# Altium project CLKE.PrjPcb
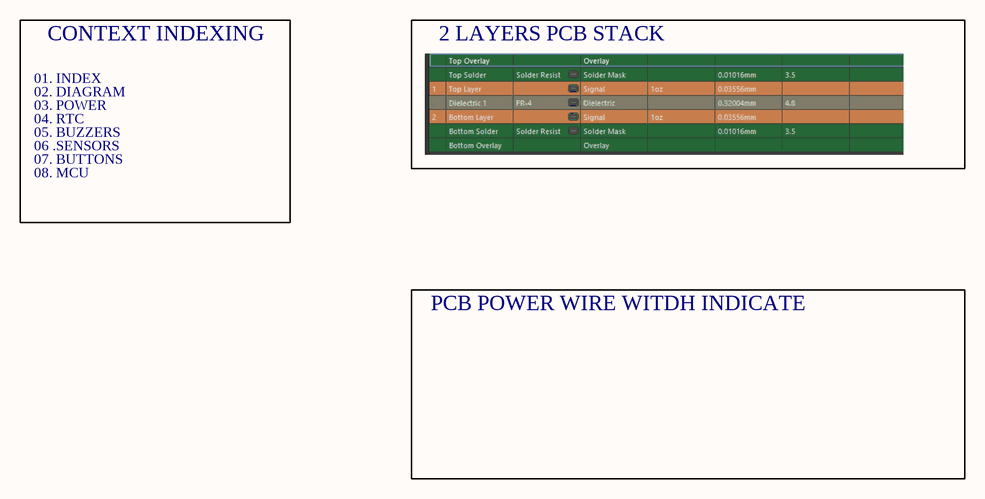
[diagram p0: INDEX.SchDoc]
9 sheets, 76 parts. Net scope: hierarchical (ports join the sheet entries above them; power ports are global).
Board file: PCB1.PcbDoc
Sheets:
  INDEX.SchDoc
  DIAGRAM.SchDoc
    POWER = POWER.SchDoc
    DISPLAY = DISPLAY.SchDoc
    SENSORS = SENSORS.SchDoc
    BUTTONS = BUTTONS.SchDoc
    RTC = RTC.SchDoc
    MCU = MCU.SchDoc
    BUZZERS = BUZZERS.SchDoc

## Sheet INDEX.SchDoc
size A4; SheetNumber: 1; SheetTotal: 9

### Notes on the sheet
- 01. INDEX
- CONTEXT INDEXING
- 2 LAYERS PCB STACK
- 02. DIAGRAM
- 03. POWER
- 04. RTC
- 05. BUZZERS
- 06 .SENSORS
- 07. BUTTONS
- 08. MCU
- PCB POWER WIRE WITDH INDICATE

## Sheet DIAGRAM.SchDoc
size A3; SheetNumber: 1; SheetTotal: 8
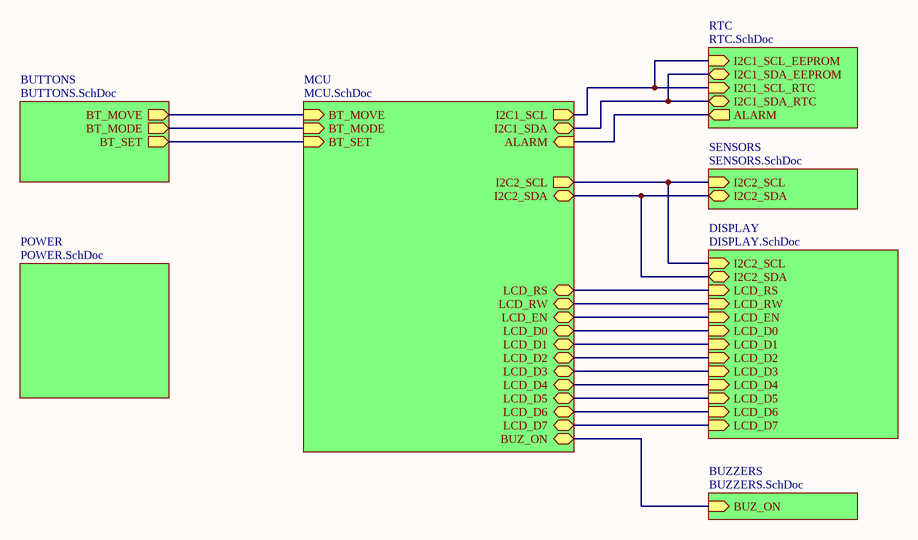
[diagram p1: DIAGRAM.SchDoc]

### Sub-sheets
BUTTONS = BUTTONS.SchDoc: BT_MOVE (out), BT_MODE (out), BT_SET (out)
BUZZERS = BUZZERS.SchDoc: BUZ_ON (in)
DISPLAY = DISPLAY.SchDoc: LCD_RS (in), LCD_RW (in), LCD_EN (in), LCD_D1 (in), LCD_D2 (in), LCD_D3 (in), LCD_D4 (in), LCD_D5 (in), LCD_D6 (in), LCD_D7 (in), I2C2_SCL (in), I2C2_SDA (bidir), LCD_D0 (in)
MCU = MCU.SchDoc: LCD_RS (bidir), LCD_RW (bidir), LCD_EN (bidir), LCD_D1 (bidir), LCD_D2 (bidir), LCD_D3 (bidir), LCD_D4 (bidir), LCD_D5 (bidir), LCD_D6 (bidir), LCD_D7 (bidir), LCD_D0 (bidir), BT_MOVE (in), BT_MODE (in), BT_SET (in), I2C2_SCL (out), I2C2_SDA (bidir), I2C1_SCL (out), I2C1_SDA (bidir), ALARM (in), BUZ_ON (bidir)
POWER = POWER.SchDoc: no entries
RTC = RTC.SchDoc: I2C1_SCL_RTC (in), I2C1_SDA_RTC (bidir), ALARM (out), I2C1_SCL_EEPROM (in), I2C1_SDA_EEPROM (bidir)
SENSORS = SENSORS.SchDoc: I2C2_SCL (in), I2C2_SDA (bidir)

### Nets
NetC8_2: sheet BUTTONS/BT_MODE, sheet MCU/BT_MODE
NetC9_2: sheet BUTTONS/BT_MOVE, sheet MCU/BT_MOVE
NetC10_2: sheet BUTTONS/BT_SET, sheet MCU/BT_SET
NetDS1_3: sheet DISPLAY/I2C2_SCL, sheet SENSORS/I2C2_SCL, sheet MCU/I2C2_SCL
NetDS1_4: sheet DISPLAY/I2C2_SDA, sheet SENSORS/I2C2_SDA, sheet MCU/I2C2_SDA
NetR2_1: sheet RTC/I2C1_SCL_RTC, sheet RTC/I2C1_SCL_EEPROM, sheet MCU/I2C1_SCL
NetR10_1: sheet RTC/I2C1_SDA_RTC, sheet RTC/I2C1_SDA_EEPROM, sheet MCU/I2C1_SDA
NetR14_1: sheet MCU/BUZ_ON, sheet BUZZERS/BUZ_ON
NetR25_1: sheet RTC/ALARM, sheet MCU/ALARM
NetU2_4: sheet DISPLAY/LCD_RS, sheet MCU/LCD_RS
NetU2_5: sheet DISPLAY/LCD_RW, sheet MCU/LCD_RW
NetU2_6: sheet DISPLAY/LCD_EN, sheet MCU/LCD_EN
NetU2_7: sheet DISPLAY/LCD_D0, sheet MCU/LCD_D0
NetU2_8: sheet DISPLAY/LCD_D1, sheet MCU/LCD_D1
NetU2_9: sheet DISPLAY/LCD_D2, sheet MCU/LCD_D2
NetU2_10: sheet DISPLAY/LCD_D3, sheet MCU/LCD_D3
NetU2_11: sheet DISPLAY/LCD_D4, sheet MCU/LCD_D4
NetU2_12: sheet DISPLAY/LCD_D5, sheet MCU/LCD_D5
NetU2_13: sheet DISPLAY/LCD_D6, sheet MCU/LCD_D6
NetU2_14: sheet DISPLAY/LCD_D7, sheet MCU/LCD_D7

## Sheet POWER.SchDoc
size A3; SheetNumber: 3; SheetTotal: 9
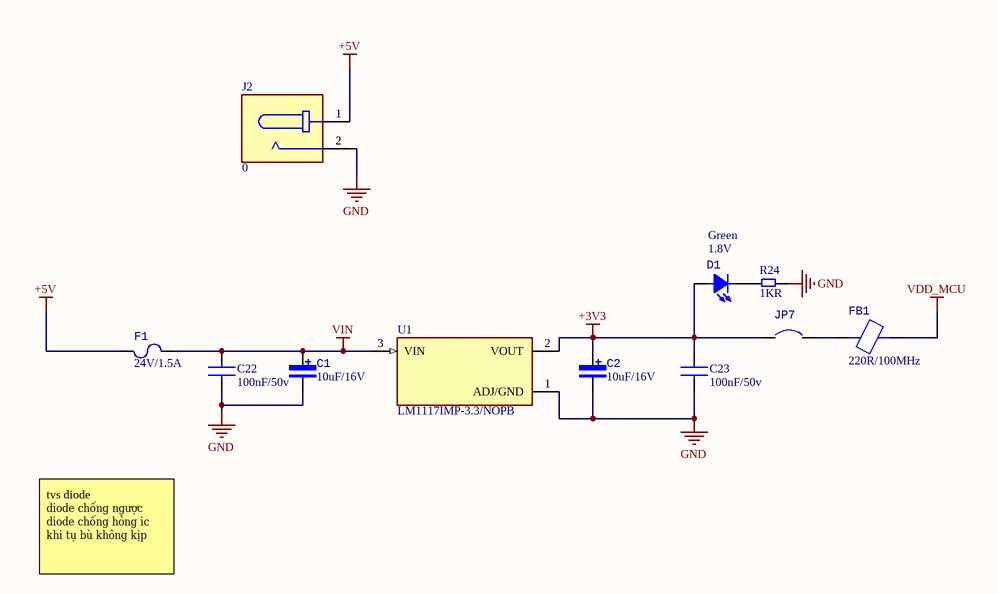
[diagram p2: POWER.SchDoc]

### Parts
C1  10uF/16V  [CAP_Tantalum_3216]
C2  10uF/16V  [CAP_Tantalum_3216]
C22  100nF/50v  [CAP-CER-0805]
C23  100nF/50v  [CAP-CER-0805]
D1  Mfr# #: Green  [LED_SMD_0805_GREEN]  (hidden comment: 1.8V)
F1  24V/1.5A  [FUSER_MF-MSMF150/24X-2]
FB1  220R/100MHz  [FERRITE-0603]
J2  0  [CUI_PJ-037AH]
JP7  JUMPER-2POS  [JUMPER-2POS-2.54]  (value not drawn)
R24  1KR  [RES-SMD-0805]
U1  LM1117IMP-3.3/NOPB  [LM1117IMP-3.3/NOPB]

### Nets
+3V3: C2.1 C23.2 D1.1(A) JP7.1 U1.2(VOUT)
+5V: F1.2 J2.1
GND: C1.2 C2.2 C22.1 C23.1 J2.2 R24.2 U1.1(ADJ/GND)
VDD_MCU: FB1.2
VIN: C1.1 C22.2 F1.1 U1.3(VIN)
NetD1_2: D1.2(K) R24.1
NetFB1_1: FB1.1 JP7.2

### Notes on the sheet
- tvs diode
  diode chống ngược
  diode chống hỏng ic khi tụ bù không kịp

### Library data of the parts
C1 C2 = ID-25: Tụ Tantalum 10uF 16V 1206 TAJA106K016RNJ; Design Item ID: ID-25; Value: 10uF/16V
C22 C23 = CAP-CER
D1 = ID-26: LED Xanh Lá 0805 Dán SMD Trong Suốt Harvatek; Design Item ID: ID-26; Value: 1.8V
F1 = ID-29: MF-MSMF150/24X-2 Cầu Chì Tự Phục Hồi 1812 24V 1.5A; Design Item ID: ID-29; Value: 24V/1.5A
FB1 = ID-27: Design Item ID: ID-27; Value: 220R/100MHz
J2 = JACK DC: 2.0 x 6.5 mm, 5.0 A, Horizontal, Through Hole, Dc Power Jack Connector; MF: Same Sky; MP: PJ-037AH; SnapEDA_Link: https://www.snapeda.com/parts/PJ-037AH/Same+Sky/view-part/?ref=snap; Package: None; Value: *; Check_prices: https://www.snapeda.com/parts/PJ-037AH/Same+Sky/view-part/?ref=eda
JP7 = ID-7: Design Item ID: ID-7
R24 = RES_SMD
U1 = LDO: 800-mA 15-V linear voltage regulator; MF: Texas Instruments; SnapEDA_Link: https://www.snapeda.com/parts/LM1117IMP-3.3/NOPB/Texas+Instruments/view-part/?ref=snap; Package: SOT-223-4 Texas Instruments; Value: *; MP: LM1117IMP-3.3/NOPB; Check_prices: https://www.snapeda.com/parts/LM1117IMP-3.3/NOPB/Texas+Instruments/view-part/?ref=eda

## Sheet DISPLAY.SchDoc
size A3; SheetNumber: 4; SheetTotal: 9
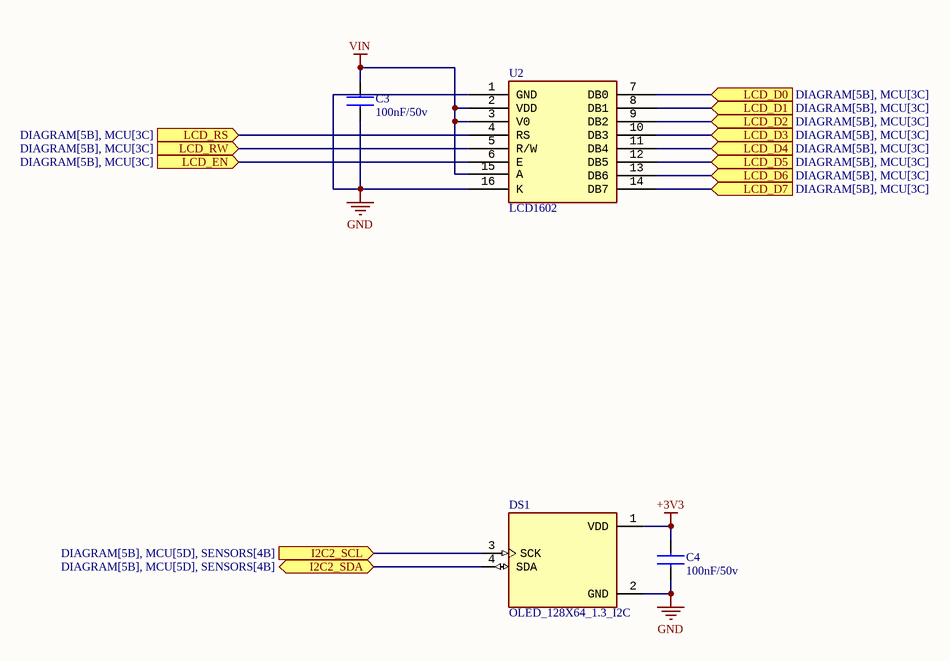
[diagram p3: DISPLAY.SchDoc]

### Parts
C3  100nF/50v  [CAP-CER-0805]
C4  100nF/50v  [CAP-CER-0805]
DS1  OLED_128X64_1.3_I2C  [LCD_OLED_128X64_1.3_I2C]
U2  LCD1602  [LCD16X2]

### Ports
I2C2_SCL (in, see DIAGRAM[5B], MCU[5D], SENSORS[4B]), I2C2_SDA (bidir, see DIAGRAM[5B], MCU[5D], SENSORS[4B]), LCD_D0 (in, see DIAGRAM[5B], MCU[3C]), LCD_D1 (in, see DIAGRAM[5B], MCU[3C]), LCD_D2 (in, see DIAGRAM[5B], MCU[3C]), LCD_D3 (in, see DIAGRAM[5B], MCU[3C]), LCD_D4 (in, see DIAGRAM[5B], MCU[3C]), LCD_D5 (in, see DIAGRAM[5B], MCU[3C]), LCD_D6 (in, see DIAGRAM[5B], MCU[3C]), LCD_D7 (in, see DIAGRAM[5B], MCU[3C]), LCD_EN (in, see DIAGRAM[5B], MCU[3C]), LCD_RS (in, see DIAGRAM[5B], MCU[3C]), LCD_RW (in, see DIAGRAM[5B], MCU[3C])

### Nets
+3V3: C4.2 DS1.1(VDD)
GND: C3.1 C4.1 DS1.2(GND) U2.1(GND) U2.16(K)
VIN: C3.2 U2.2(VDD) U2.3(V0) U2.15(A)
NetDS1_3: DS1.3(SCK) ; port I2C2_SCL
NetDS1_4: DS1.4(SDA) ; port I2C2_SDA
NetU2_4: U2.4(RS) ; port LCD_RS
NetU2_5: U2.5(R/W) ; port LCD_RW
NetU2_6: U2.6(E) ; port LCD_EN
NetU2_7: U2.7(DB0) ; port LCD_D0
NetU2_8: U2.8(DB1) ; port LCD_D1
NetU2_9: U2.9(DB2) ; port LCD_D2
NetU2_10: U2.10(DB3) ; port LCD_D3
NetU2_11: U2.11(DB4) ; port LCD_D4
NetU2_12: U2.12(DB5) ; port LCD_D5
NetU2_13: U2.13(DB6) ; port LCD_D6
NetU2_14: U2.14(DB7) ; port LCD_D7

### Library data of the parts
C3 C4 = CAP-CER
DS1 = ID-5: MF: UNIVERSAL-SOLDER Electronics Ltd; MP: OLED 128x64 1.3&quot; I2C; SnapEDA_Link: https://www.snapeda.com/parts/OLED%20128x64%201.3%22%20I2C/UNIVERSAL-SOLDER+Electronics+Ltd/view-part/?ref=snap; Package: None; Value: *; Check_prices: https://www.snapeda.com/parts/OLED%20128x64%201.3%22%20I2C/UNIVERSAL-SOLDER+Electronics+Ltd/view-part/?ref=eda; Design Item ID: ID-5; Mfr# #: OLED_128X64_1.3_I2C

## Sheet SENSORS.SchDoc
size A3; SheetNumber: 6; SheetTotal: 8
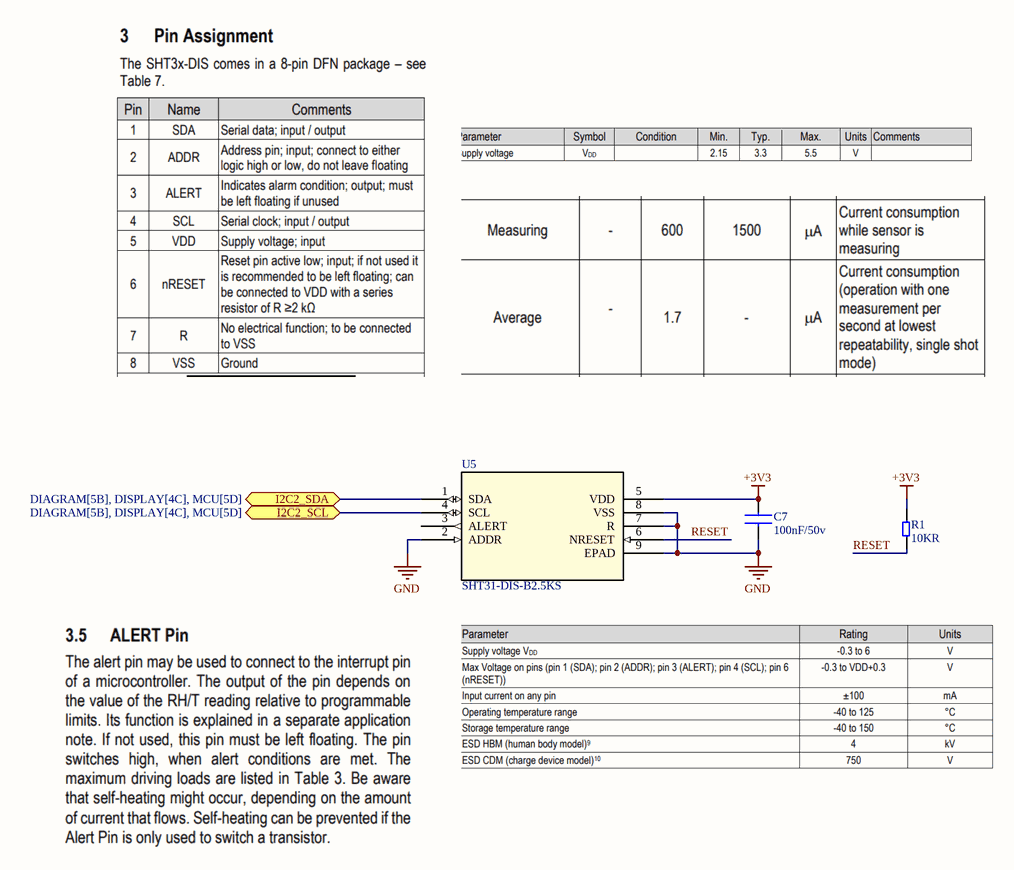
[diagram p4: SENSORS.SchDoc]

### Parts
C7  100nF/50v  [CAP-CER-0805]
R1  10KR  [RES-SMD-0805]
U5  SHT31-DIS-B2.5KS  [SHT31-DIS-B2.5KS_U_SHT3_SEN]

### Ports
I2C2_SCL (bidir, see DIAGRAM[5B], DISPLAY[4C], MCU[5D]), I2C2_SDA (bidir, see DIAGRAM[5B], DISPLAY[4C], MCU[5D])

### Nets
+3V3: C7.2 R1.2 U5.5(VDD)
GND: C7.1 U5.2(ADDR) U5.7(R) U5.8(VSS) U5.9(EPAD)
RESET: R1.1 U5.6(NRESET)
NetDS1_3: U5.4(SCL) ; port I2C2_SCL
NetDS1_4: U5.1(SDA) ; port I2C2_SDA

Not connected (* = marked no-connect by the designer): U5 3(ALERT)

### Library data of the parts
C7 = CAP-CER
R1 = ID-4: Điện Trở 10 KOhm 0805 1%; Design Item ID: ID-4; Value: 10KR
U5 = ID-3: Humidity, Temperature 0 ~ 100% RH I2C ±2% RH 8 s Surface Mount; Manufacturer_Name: Sensirion; Copyright: Copyright (C) 2025 Ultra Librarian. All rights reserved.; Manufacturer_Part_Number: SHT31-DIS-B2.5KS; RefDes: RefDes; Type: Type; Design Item ID: ID-3; Mfr# #: SHT31-DIS-B2.5KS

## Sheet BUTTONS.SchDoc
size A3; SheetNumber: 7; SheetTotal: 8
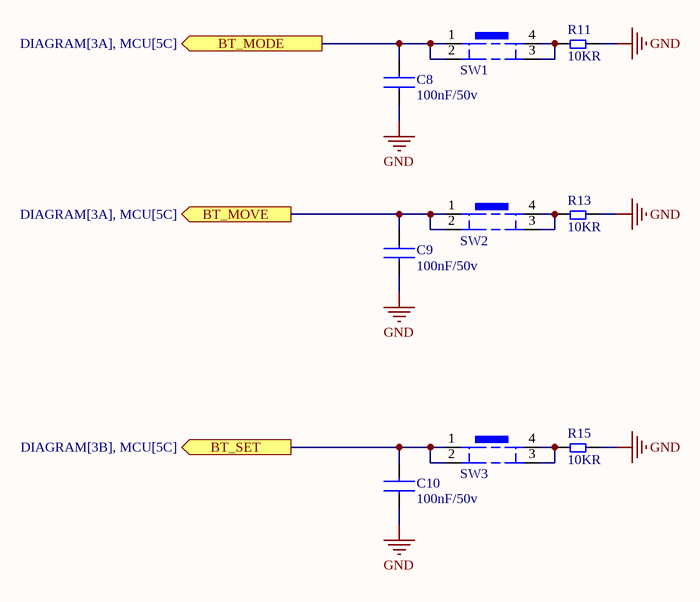
[diagram p5: BUTTONS.SchDoc]

### Parts
C8  100nF/50v  [CAP-CER-0805]
C9  100nF/50v  [CAP-CER-0805]
C10  100nF/50v  [CAP-CER-0805]
R11  10KR  [RES-SMD-0805]
R13  10KR  [RES-SMD-0805]
R15  10KR  [RES-SMD-0805]
SW1  0  [Tactice-Switch-TH-12x12-4.5mm]  (value not drawn)
SW2  0  [Tactice-Switch-TH-12x12-4.5mm]  (value not drawn)
SW3  0  [Tactice-Switch-TH-12x12-4.5mm]  (value not drawn)

### Ports
BT_MODE (out, see DIAGRAM[3A], MCU[5C]), BT_MOVE (out, see DIAGRAM[3A], MCU[5C]), BT_SET (out, see DIAGRAM[3B], MCU[5C])

### Nets
GND: C8.1 C9.1 C10.1 R11.1 R13.1 R15.1
NetC8_2: C8.2 SW1.1 SW1.2 ; port BT_MODE
NetC9_2: C9.2 SW2.1 SW2.2 ; port BT_MOVE
NetC10_2: C10.2 SW3.1 SW3.2 ; port BT_SET
NetR11_2: R11.2 SW1.3 SW1.4
NetR13_2: R13.2 SW2.3 SW2.4
NetR15_2: R15.2 SW3.3 SW3.4

### Library data of the parts
C8-C10 = ID-14: Tụ Gốm 0805 100nF (0.1uF) 50V; Design Item ID: ID-14; Value: 100nF/50v
R11 R13 R15 = ID-4: Điện Trở 10 KOhm 0805 1%; Design Item ID: ID-4; Value: 10KR
SW1-SW3 = ID-18: Nút Nhấn 6x6mm Cao 6mm 4 Chân Xuyên Lỗ; Design Item ID: ID-18

## Sheet RTC.SchDoc
size A3; SheetNumber: 5; SheetTotal: 9
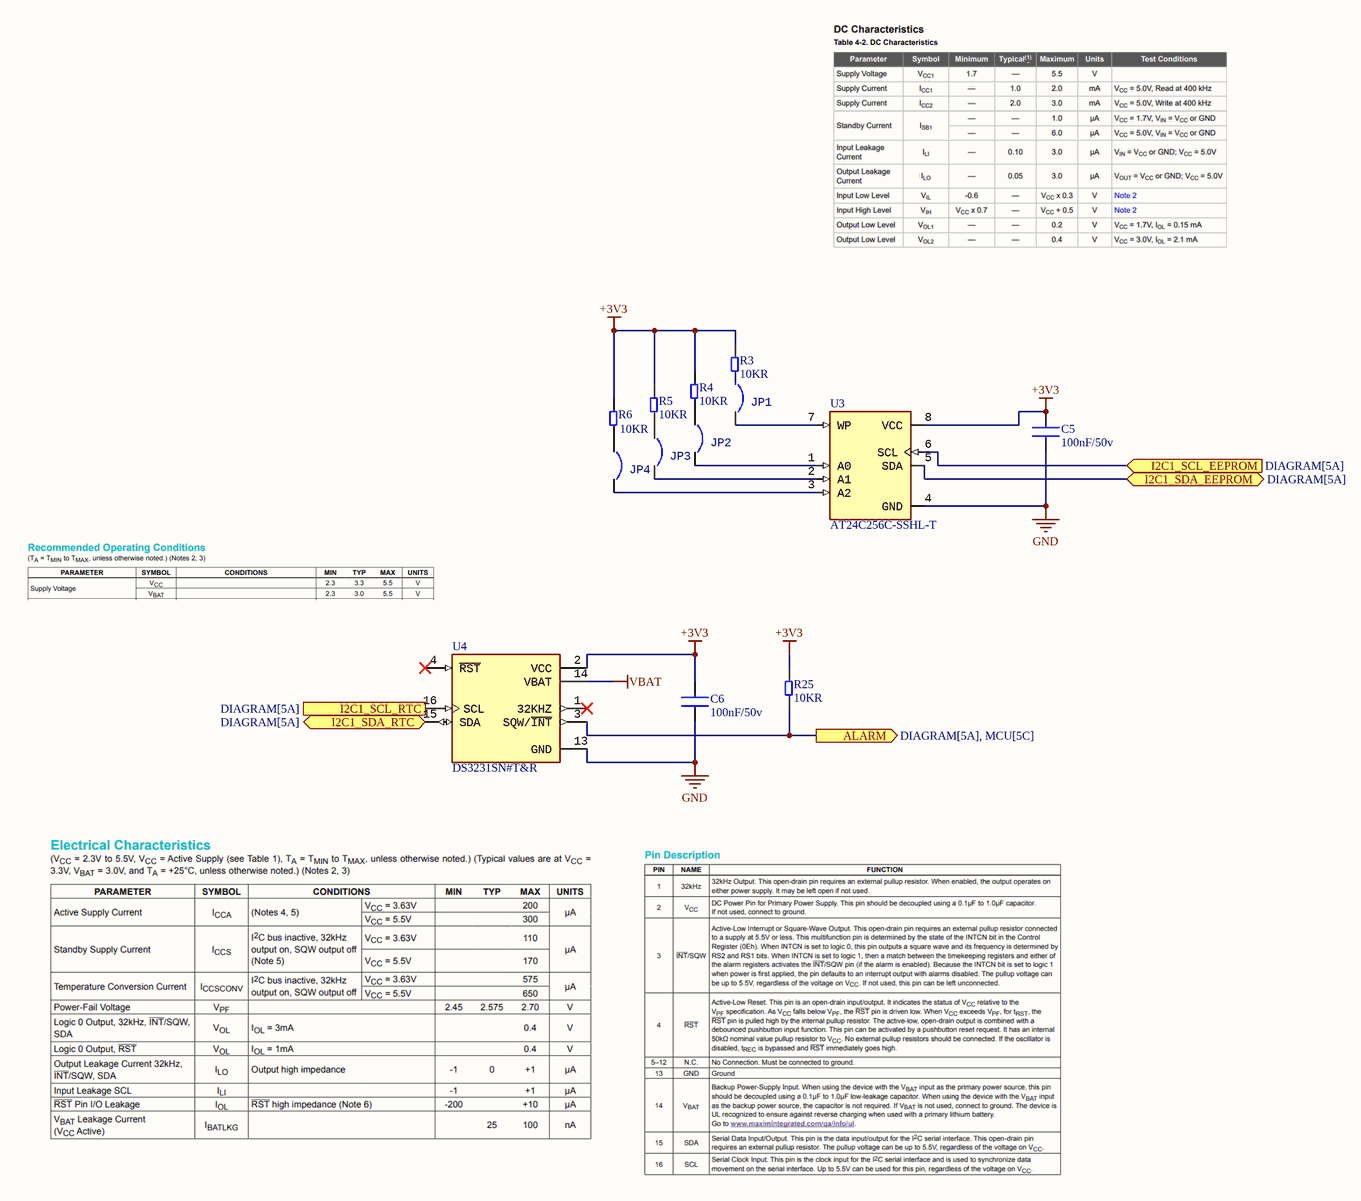
[diagram p6: RTC.SchDoc]

### Parts
C5  100nF/50v  [CAP-CER-0805]
C6  100nF/50v  [CAP-CER-0805]
JP1  JUMPER-2POS  [JUMPER-2POS-2.54]  (value not drawn)
JP2  JUMPER-2POS  [JUMPER-2POS-2.54]  (value not drawn)
JP3  JUMPER-2POS  [JUMPER-2POS-2.54]  (value not drawn)
JP4  JUMPER-2POS  [JUMPER-2POS-2.54]  (value not drawn)
R3  10KR  [RES-SMD-0805]
R4  10KR  [RES-SMD-0805]
R5  10KR  [RES-SMD-0805]
R6  10KR  [RES-SMD-0805]
R25  10KR  [RES-SMD-0805]
U3  AT24C256C-SSHL-T  [AT24C256C-SSHL-T]
U4  DS3231SN#T&R  [DS3231SN_SOIC127P1032X265-16N]

### Ports
ALARM (out, see DIAGRAM[5A], MCU[5C]), I2C1_SCL_EEPROM (in, see DIAGRAM[5A]), I2C1_SCL_RTC (in, see DIAGRAM[5A]), I2C1_SDA_EEPROM (bidir, see DIAGRAM[5A]), I2C1_SDA_RTC (bidir, see DIAGRAM[5A])

### Nets
+3V3: C5.2 C6.2 R3.2 R4.2 R5.2 R6.2 R25.2 U3.8(VCC) U4.2(VCC)
GND: C5.1 C6.1 U3.4(GND) U4.13(GND)
VBAT: U4.14(VBAT)
NetJP1_1: JP1.1 R3.1
NetJP1_2: JP1.2 U3.7(WP)
NetJP2_1: JP2.1 R4.1
NetJP2_2: JP2.2 U3.1(A0)
NetJP3_1: JP3.1 R5.1
NetJP3_2: JP3.2 U3.2(A1)
NetJP4_1: JP4.1 R6.1
NetJP4_2: JP4.2 U3.3(A2)
NetR2_1: U3.6(SCL) U4.16(SCL) ; port I2C1_SCL_EEPROM, port I2C1_SCL_RTC
NetR10_1: U3.5(SDA) U4.15(SDA) ; port I2C1_SDA_EEPROM, port I2C1_SDA_RTC
NetR25_1: R25.1 U4.3(SQW/~{INT}) ; port ALARM

Not connected (* = marked no-connect by the designer): U4 1(32KHZ)* 4(~{RST})*

### Library data of the parts
C5 C6 = CAP-CER
JP1-JP4 = ID-7: Design Item ID: ID-7
R3-R6 R25 = RES_SMD
U3 = ID-9: EEPROM Memory IC 256Kbit I2C 1 MHz 550 ns 8-SOIC; Design Item ID: ID-9; Mfr# #: AT24C256C-SSHL-T
U4 = ID-8: Real Time Clock (RTC) IC Clock/Calendar I2C, 2-Wire Serial 16-SOIC (0.295", 7.50mm Width); Design Item ID: ID-8; Mfr# #: DS3231SN#T&R

## Sheet MCU.SchDoc
size A3; SheetNumber: 8; SheetTotal: 9
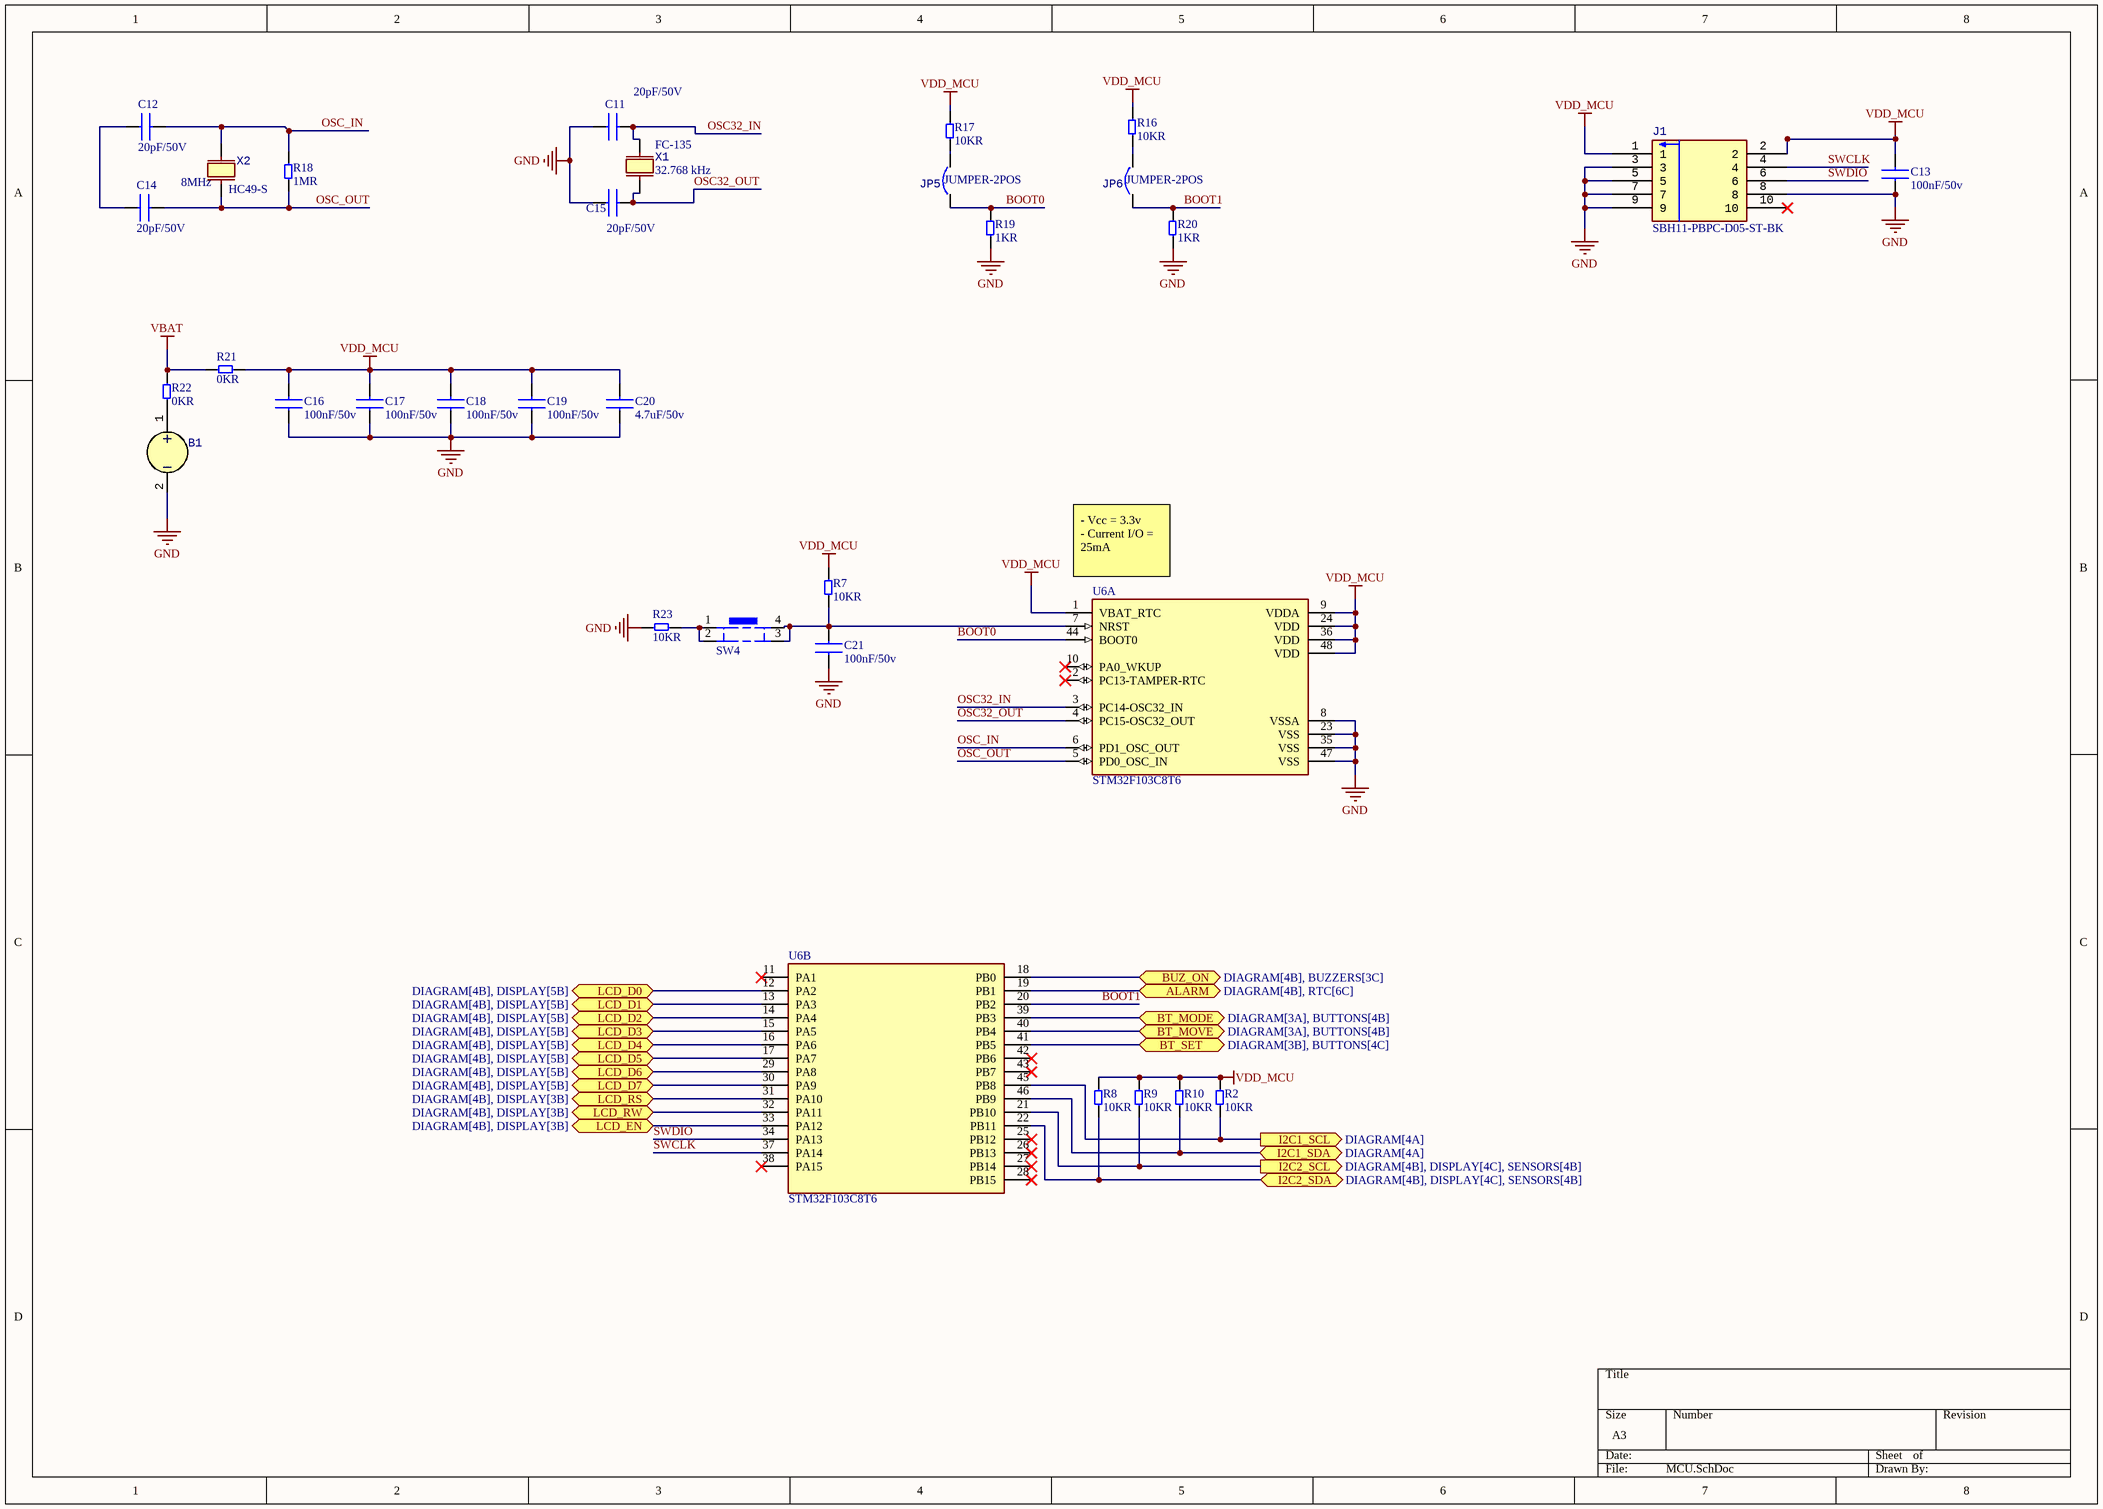
[diagram p7: MCU.SchDoc]

### Parts
B1  0  [BAT-HOLD-2032]  (value not drawn)
C11  20pF/50V  [CAP-CER-0805]
C12  20pF/50V  [CAP-CER-0805]
C13  100nF/50v  [CAP-CER-0805]
C14  20pF/50V  [CAP-CER-0805]
C15  20pF/50V  [CAP-CER-0805]
C16  100nF/50v  [CAP-CER-0805]
C17  100nF/50v  [CAP-CER-0805]
C18  100nF/50v  [CAP-CER-0805]
C19  100nF/50v  [CAP-CER-0805]
C20  4.7uF/50v  [CAP-CER-0805]
C21  100nF/50v  [CAP-CER-0805]
J1  SBH11-PBPC-D05-ST-BK  [IDC-10POS-2.54]
JP5  JUMPER-2POS  [JUMPER-2POS-2.54]
JP6  JUMPER-2POS  [JUMPER-2POS-2.54]
R2  10KR  [RES-SMD-0805]
R7  10KR  [RES-SMD-0805]
R8  10KR  [RES-SMD-0805]
R9  10KR  [RES-SMD-0805]
R10  10KR  [RES-SMD-0805]
R16  10KR  [RES-SMD-0805]
R17  10KR  [RES-SMD-0805]
R18  1MR  [RES-SMD-0805]
R19  1KR  [RES-SMD-0805]
R20  1KR  [RES-SMD-0805]
R21  0KR  [RES-SMD-0805]
R22  0KR  [RES-SMD-0805]
R23  10KR  [RES-SMD-0805]
SW4  0  [Tactice-Switch-TH-12x12-4.5mm]  (value not drawn)
U6  STM32F103C8T6  [QFP50P900X900X160-48N]  (parts A,B of 2)
X1  Mfr# #: FC-135  [XTAL_FC-135_32.7680KA-A0]  (hidden comment: 32.768 kHz)
X2  8MHz  [HC49-S]

### Ports
ALARM (bidir, see DIAGRAM[4B], RTC[6C]), BT_MODE (bidir, see DIAGRAM[3A], BUTTONS[4B]), BT_MOVE (bidir, see DIAGRAM[3A], BUTTONS[4B]), BT_SET (bidir, see DIAGRAM[3B], BUTTONS[4C]), BUZ_ON (bidir, see DIAGRAM[4B], BUZZERS[3C]), I2C1_SCL (out, see DIAGRAM[4A]), I2C1_SDA (bidir, see DIAGRAM[4A]), I2C2_SCL (out, see DIAGRAM[4B], DISPLAY[4C], SENSORS[4B]), I2C2_SDA (bidir, see DIAGRAM[4B], DISPLAY[4C], SENSORS[4B]), LCD_D0 (bidir, see DIAGRAM[4B], DISPLAY[5B]), LCD_D1 (bidir, see DIAGRAM[4B], DISPLAY[5B]), LCD_D2 (bidir, see DIAGRAM[4B], DISPLAY[5B]), LCD_D3 (bidir, see DIAGRAM[4B], DISPLAY[5B]), LCD_D4 (bidir, see DIAGRAM[4B], DISPLAY[5B]), LCD_D5 (bidir, see DIAGRAM[4B], DISPLAY[5B]), LCD_D6 (bidir, see DIAGRAM[4B], DISPLAY[5B]), LCD_D7 (bidir, see DIAGRAM[4B], DISPLAY[5B]), LCD_EN (bidir, see DIAGRAM[4B], DISPLAY[3B]), LCD_RS (bidir, see DIAGRAM[4B], DISPLAY[3B]), LCD_RW (bidir, see DIAGRAM[4B], DISPLAY[3B])

### Nets
GND: B1.2(-) C11.1 C13.1 C15.1 C16.1 C17.1 C18.1 C19.1 C20.1 C21.2 J1.3 J1.5 J1.7 J1.8 J1.9 R19.1 R20.1 R23.1 U6.8(VSSA) U6.23(VSS) U6.35(VSS) U6.47(VSS)
VBAT: R21.1 R22.2
VDD_MCU: C13.2 C16.2 C17.2 C18.2 C19.2 C20.2 J1.1 J1.2 R2.2 R7.2 R8.2 R9.2 R10.2 R16.2 R17.2 R21.2 U6.1(VBAT_RTC) U6.9(VDDA) U6.24(VDD) U6.36(VDD) U6.48(VDD)
BOOT0: JP5.1 R19.2 U6.44(BOOT0)
BOOT1: JP6.1 R20.2 U6.20(PB2)
OSC32_IN: C11.2 U6.3(PC14-OSC32_IN) X1.2
OSC32_OUT: C15.2 U6.4(PC15-OSC32_OUT) X1.1
OSC_IN: C12.2 R18.2 U6.6(PD1_OSC_OUT) X2.2
OSC_OUT: C14.2 R18.1 U6.5(PD0_OSC_IN) X2.1
SWCLK: J1.4 U6.37(PA14)
SWDIO: J1.6 U6.34(PA13)
NetB1_1: B1.1(+) R22.1
NetC8_2: U6.39(PB3) ; port BT_MODE
NetC9_2: U6.40(PB4) ; port BT_MOVE
NetC10_2: U6.41(PB5) ; port BT_SET
NetC12_1: C12.1 C14.1
NetC21_1: C21.1 R7.1 SW4.3 SW4.4 U6.7(NRST)
NetDS1_3: R9.1 U6.21(PB10) ; port I2C2_SCL
NetDS1_4: R8.1 U6.22(PB11) ; port I2C2_SDA
NetJP5_2: JP5.2 R17.1
NetJP6_2: JP6.2 R16.1
NetR2_1: R2.1 U6.45(PB8) ; port I2C1_SCL
NetR10_1: R10.1 U6.46(PB9) ; port I2C1_SDA
NetR14_1: U6.18(PB0) ; port BUZ_ON
NetR23_2: R23.2 SW4.1 SW4.2
NetR25_1: U6.19(PB1) ; port ALARM
NetU2_4: U6.31(PA10) ; port LCD_RS
NetU2_5: U6.32(PA11) ; port LCD_RW
NetU2_6: U6.33(PA12) ; port LCD_EN
NetU2_7: U6.12(PA2) ; port LCD_D0
NetU2_8: U6.13(PA3) ; port LCD_D1
NetU2_9: U6.14(PA4) ; port LCD_D2
NetU2_10: U6.15(PA5) ; port LCD_D3
NetU2_11: U6.16(PA6) ; port LCD_D4
NetU2_12: U6.17(PA7) ; port LCD_D5
NetU2_13: U6.29(PA8) ; port LCD_D6
NetU2_14: U6.30(PA9) ; port LCD_D7

Not connected (* = marked no-connect by the designer): J1 10*; U6 2(PC13-TAMPER-RTC)* 10(PA0_WKUP)* 11(PA1)* 25(PB12)* 26(PB13)* 27(PB14)* 28(PB15)* 38(PA15)* 42(PB6)* 43(PB7)*

### Notes on the sheet
- (near U6) - Vcc = 3.3v
  - Current I/O = 25mA

### Library data of the parts
B1 = ID-20: Design Item ID: ID-20
C11 C12 C14 C15 = ID-11: 0805 20pF 50V; Design Item ID: ID-11; Value: 20pF/50V
C13 C16-C19 C21 = ID-14: Tụ Gốm 0805 100nF (0.1uF) 50V; Design Item ID: ID-14; Value: 100nF/50v
C20 = ID-15: Tụ Gốm 0805 4.7uF 50V; Design Item ID: ID-15; Value: 4.7uF/50v
J1 = ID-16: Design Item ID: ID-16; Mfr# #: SBH11-PBPC-D05-ST-BK
JP5 JP6 = ID-7: Design Item ID: ID-7; Mfr# #: JUMPER-2POS
R2 R7-R10 R16 R17 R23 = ID-4: Điện Trở 10 KOhm 0805 1%; Design Item ID: ID-4; Value: 10KR
R18 = ID-12: Điện Trở 1 MOhm 0805 1%; Design Item ID: ID-12; Value: 1MR
R19 R20 = ID-19: Điện Trở 1 KOhm 0805 1%; Design Item ID: ID-19; Value: 1KR
R21 R22 = ID-21: Điện Trở 0 Ohm 0805 1%; Design Item ID: ID-21; Value: 0KR
SW4 = ID-18: Nút Nhấn 6x6mm Cao 6mm 4 Chân Xuyên Lỗ; Design Item ID: ID-18
U6 = STM32F103C8T6: ARM® Cortex®-M3 STM32F1 Microcontroller IC 32-Bit 72MHz 64KB (64K x 8) FLASH 48-LQFP (7x7); MF: STMicroelectronics; SnapEDA_Link: https://www.snapeda.com/parts/STM32F103C8T6/STMicroelectronics/view-part/?ref=snap; Package: LQFP-48 STMicroelectronics; Value: *; MP: STM32F103C8T6; Check_prices: https://www.snapeda.com/parts/STM32F103C8T6/STMicroelectronics/view-part/?ref=eda
X1 = ID-13: Thạch Anh FC-135 32.768KHz 3215; Design Item ID: ID-13; Value: 32.768 kHz
X2 = ID-10: 8 MHz ±30ppm Crystal 18pF 100 Ohms HC-49/US; Design Item ID: ID-10; Mfr# #: HC49-S; Value: 8MHz

## Sheet BUZZERS.SchDoc
size A3; SheetNumber: 5; SheetTotal: 8
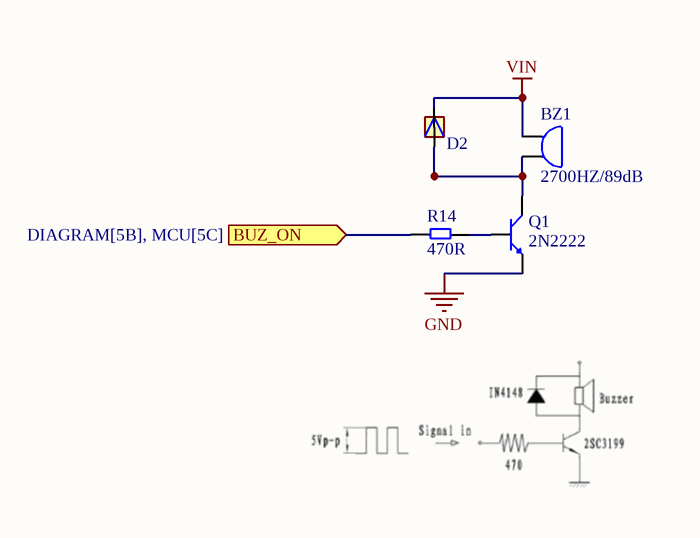
[diagram p8: BUZZERS.SchDoc]

### Parts
BZ1  2700HZ/89dB  [BUZZER_1209]
D2  0.15A/75V  [SOD323]  (value not drawn)
Q1  2N2222  [TO92254P470H750-3]
R14  470R  [RES-SMD-0805]

### Ports
BUZ_ON (in, see DIAGRAM[5B], MCU[5C])

### Nets
GND: Q1.1(E)
VIN: BZ1.1 D2.C
NetBZ1_2: BZ1.2 D2.A Q1.2(C)
NetQ1_3: Q1.3(B) R14.2
NetR14_1: R14.1 ; port BUZ_ON

### Library data of the parts
BZ1 = BUZZER
D2 = ID-32: 1N4148W Diode Chỉnh Lưu 0.15A 75V SOD323; MF: Diotec Semiconductor; MP: 1N4148WS; SnapEDA_Link: https://www.snapeda.com/parts/1N4148WS/Diotec/view-part/?ref=snap; Package: SOD-323F Diotec; Value: 0.15A/75V; Check_prices: https://www.snapeda.com/parts/1N4148WS/Diotec/view-part/?ref=eda; Design Item ID: ID-32
Q1 = ID-30: P2N2222A Transistor NPN 40V 0.6A 3 Chân TO-92; Design Item ID: ID-30; Value: 2N2222
R14 = ID-31: Điện Trở 470 Ohm 0805 1%; Design Item ID: ID-31; Value: 470R

## Nets that join several sheets
+3V3: POWER (5 pins), DISPLAY (C4.2 DS1.1), SENSORS (C7.2 R1.2 U5.5), RTC (9 pins)
GND: POWER (7 pins), DISPLAY (5 pins), SENSORS (5 pins), BUTTONS (6 pins), RTC (C5.1 C6.1 U3.4 U4.13), MCU (22 pins), BUZZERS (Q1.1)
VBAT: RTC (U4.14), MCU (R21.1 R22.2)
VDD_MCU: POWER (FB1.2), MCU (21 pins)
VIN: POWER (C1.1 C22.2 F1.1 U1.3), DISPLAY (C3.2 U2.2 U2.3 U2.15), BUZZERS (BZ1.1 D2.C)
NetC8_2: BUTTONS (C8.2 SW1.1 SW1.2), MCU (U6.39)
NetC9_2: BUTTONS (C9.2 SW2.1 SW2.2), MCU (U6.40)
NetC10_2: BUTTONS (C10.2 SW3.1 SW3.2), MCU (U6.41)
NetDS1_3: DISPLAY (DS1.3), SENSORS (U5.4), MCU (R9.1 U6.21)
NetDS1_4: DISPLAY (DS1.4), SENSORS (U5.1), MCU (R8.1 U6.22)
NetR2_1: RTC (U3.6 U4.16), MCU (R2.1 U6.45)
NetR10_1: RTC (U3.5 U4.15), MCU (R10.1 U6.46)
NetR14_1: MCU (U6.18), BUZZERS (R14.1)
NetR25_1: RTC (R25.1 U4.3), MCU (U6.19)
NetU2_4: DISPLAY (U2.4), MCU (U6.31)
NetU2_5: DISPLAY (U2.5), MCU (U6.32)
NetU2_6: DISPLAY (U2.6), MCU (U6.33)
NetU2_7: DISPLAY (U2.7), MCU (U6.12)
NetU2_8: DISPLAY (U2.8), MCU (U6.13)
NetU2_9: DISPLAY (U2.9), MCU (U6.14)
NetU2_10: DISPLAY (U2.10), MCU (U6.15)
NetU2_11: DISPLAY (U2.11), MCU (U6.16)
NetU2_12: DISPLAY (U2.12), MCU (U6.17)
NetU2_13: DISPLAY (U2.13), MCU (U6.29)
NetU2_14: DISPLAY (U2.14), MCU (U6.30)